# Altium schematic sheet Analog.SchDoc
size A4; Organization: Altium Limited; Address1: L3, 12a Rodborough Rd; Address2: Frenchs Forest; Address3: NSW; Address4: Australia 2086
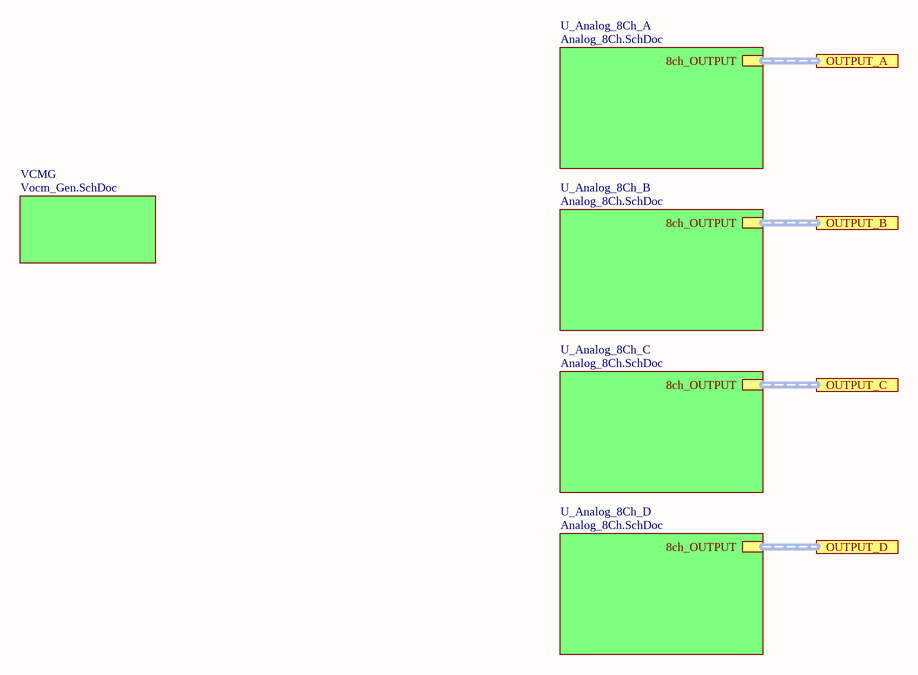
[diagram p0: Analog.SchDoc]

## Sub-sheets
U_Analog_8Ch_A = Analog_8Ch.SchDoc: 8ch_OUTPUT (harness 8ch_sig)
U_Analog_8Ch_B = Analog_8Ch.SchDoc: 8ch_OUTPUT (harness 8ch_sig)
U_Analog_8Ch_C = Analog_8Ch.SchDoc: 8ch_OUTPUT (harness 8ch_sig)
U_Analog_8Ch_D = Analog_8Ch.SchDoc: 8ch_OUTPUT (harness 8ch_sig)
VCMG = Vocm_Gen.SchDoc: no entries

## Ports
OUTPUT_A (harness 8ch_sig), OUTPUT_B (harness 8ch_sig), OUTPUT_C (harness 8ch_sig), OUTPUT_D (harness 8ch_sig)

## Buses and harness runs
harness port OUTPUT_A = sheet U_Analog_8Ch_A/8ch_OUTPUT
harness port OUTPUT_B = sheet U_Analog_8Ch_B/8ch_OUTPUT
harness port OUTPUT_C = sheet U_Analog_8Ch_C/8ch_OUTPUT
harness port OUTPUT_D = sheet U_Analog_8Ch_D/8ch_OUTPUT

## Notes on the sheet
- Project Name:
- Revision:
- File Name:
- Date:
- Nuclear Instruments srl
- Via Lecco, 16, Lambrugo, Italy
- +39 031 2289570
- info@nuclearinstruments.eu
- http://www.nuclearinstruments.eu